# EAGLE schematic Test board - MCP73871 (EAGLE 9.6.2)
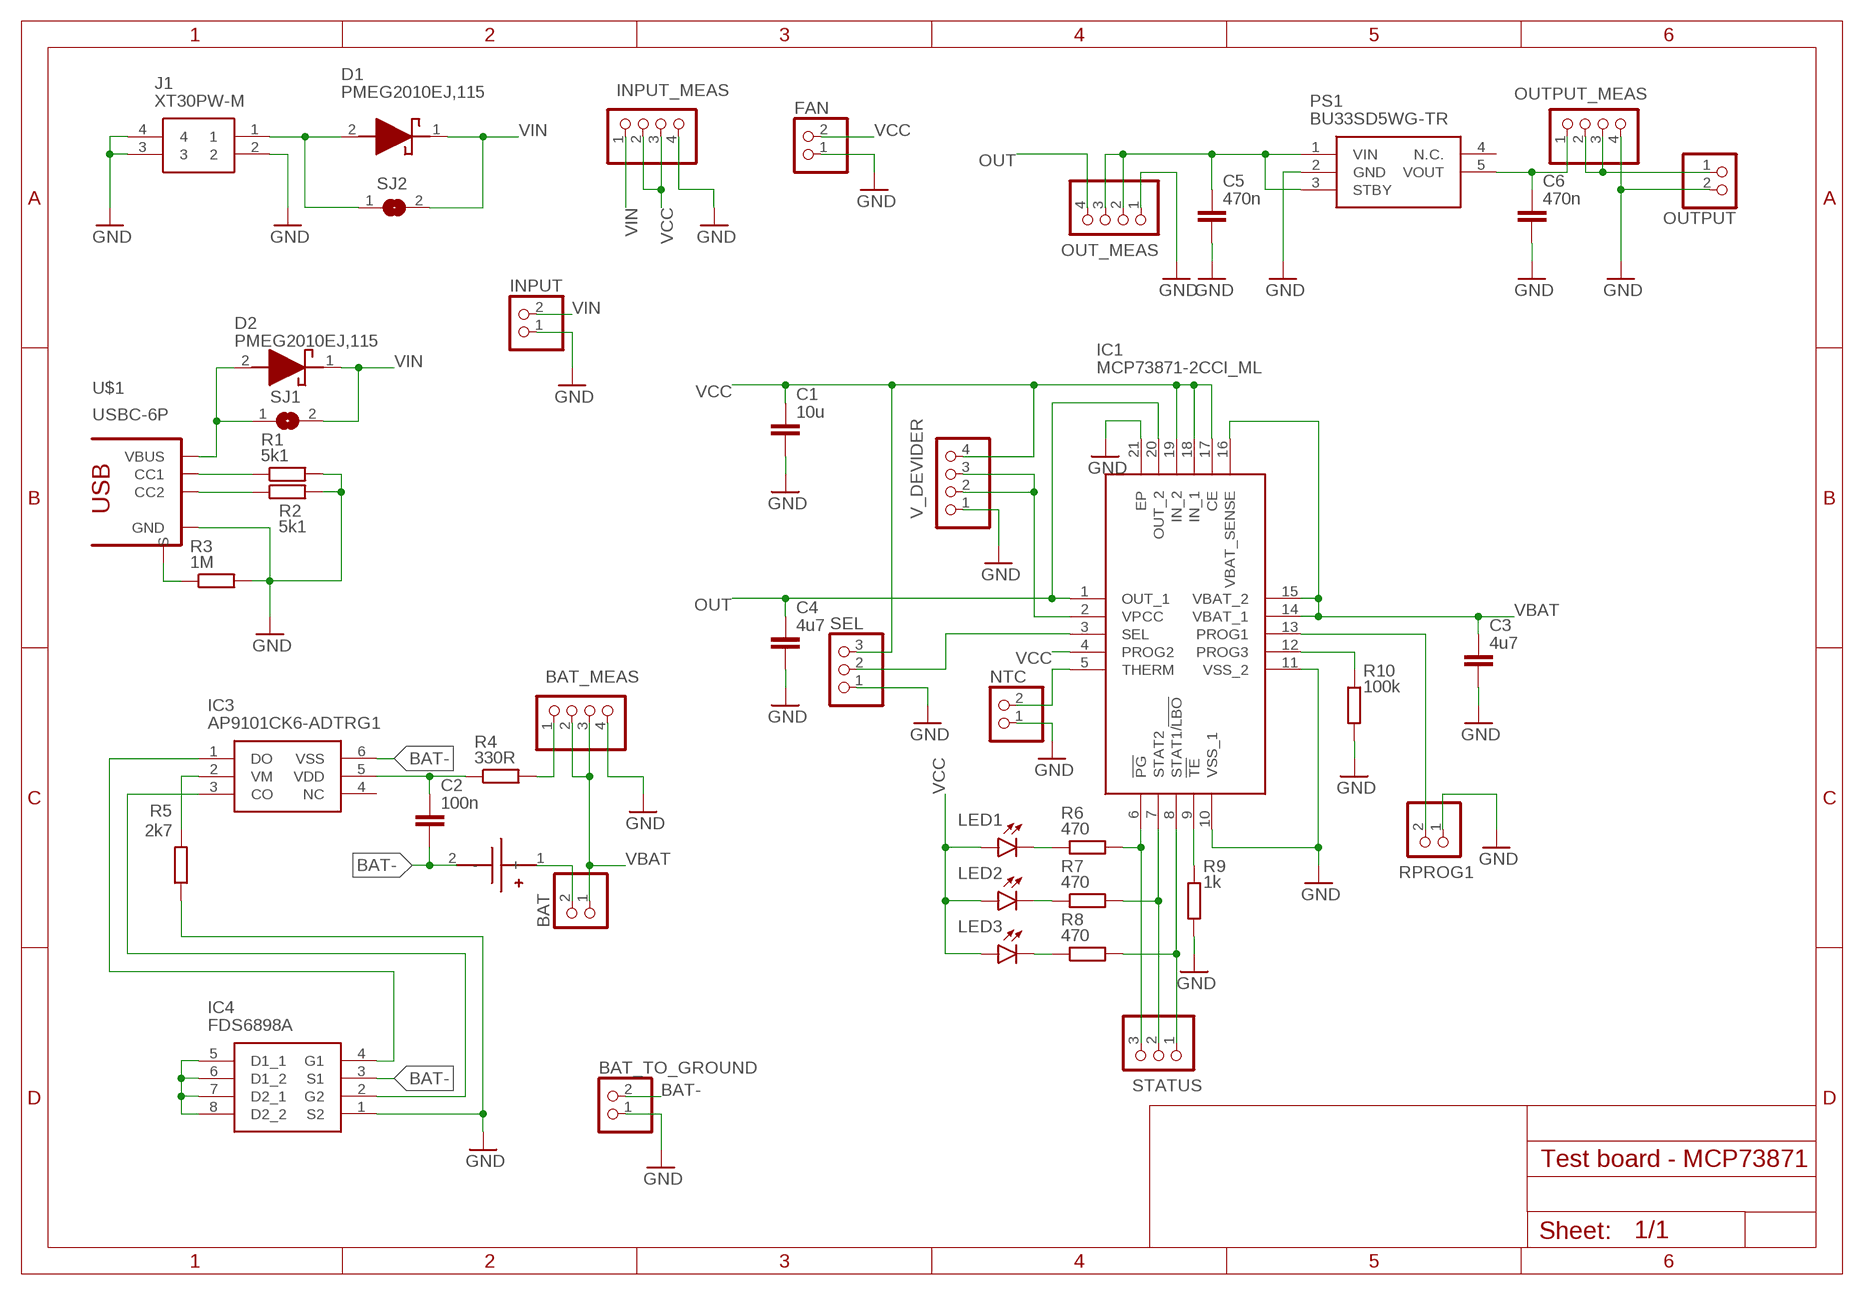
[diagram p0: schematic, sheet 1]

## Parts
BAT  PINHD-1X2  [1X02]
BAT_MEAS  PINHD-1X4  [1X04]
BAT_TO_GROUND  PINHD-1X2  [1X02]
C1  10u  C-EUC0805  [C0805]
C2  100n  C-EUC0805  [C0805]
C3  4u7  C-EUC0805  [C0805]
C4  4u7  C-EUC0805  [C0805]
C5  470n  C-EUC0805  [C0805]
C6  470n  C-EUC0805  [C0805]
D1  PMEG2010EJ,115  [SODFL2512X80N]
D2  PMEG2010EJ,115  [SODFL2512X80N]
FAN  PINHD-1X2  [1X02]
IC1  MCP73871-2CCI_ML  [QFN50P400X400X100-21N]
IC3  AP9101CK6-ADTRG1  [SOT95P285X140-6N]
IC4  FDS6898A  [SOIC127P600X175-8N]
INPUT  PINHD-1X2  [1X02]
INPUT_MEAS  PINHD-1X4  [1X04]
J1  XT30PW-M  [XT30PWM]
LED1  !PG  LEDCHIPLED_0805  [CHIPLED_0805]
LED2  STAT2  LEDCHIPLED_0805  [CHIPLED_0805]
LED3  STAT1  LEDCHIPLED_0805  [CHIPLED_0805]
NTC  PINHD-1X2  [1X02]
OUT_MEAS  PINHD-1X4  [1X04]
OUTPUT  PINHD-1X2  [1X02]
OUTPUT_MEAS  PINHD-1X4  [1X04]
PS1  BU33SD5WG-TR  [SOT95P280X125-5N]
R1  5k1  R-EU_R0805  [R0805]
R2  5k1  R-EU_R0805  [R0805]
R3  1M  R-EU_R0805  [R0805]
R4  330R  R-EU_R0805  [R0805]
R5  2k7  R-EU_R0805  [R0805]
R6  470  R-EU_R0805  [R0805]
R7  470  R-EU_R0805  [R0805]
R8  470  R-EU_R0805  [R0805]
R9  1k  R-EU_R0805  [R0805]
R10  100k  R-EU_R0805  [R0805]
RPROG1  PINHD-1X2  [1X02]
SEL  PINHD-1X3  [1X03]
SJ1  SJ  [SJ]
SJ2  SJ  [SJ]
STATUS  PINHD-1X3  [1X03]
U$1  USBC-6P  [USCX-06FX-XXMX-01]
U$2  BLOSSOM-BLM-18650-1PCS  [BLOSSOM-BLM-18650-1PCS]
V_DEVIDER  PINHD-1X4  [1X04]

## Nets
!PG: IC1.6(!PG) R6.2 STATUS.3
!TE: IC1.9(!TE) R9.1
BAT+: BAT.2 U$2.1(+)
BAT-: BAT_TO_GROUND.2 C2.2 IC3.6(VSS) IC4.3(S1) U$2.2(-)
CC1: R1.1 U$1.CC1
CC2: R2.1 U$1.CC2
DRAIN: IC4.5(D1_1) IC4.6(D1_2) IC4.7(D2_1) IC4.8(D2_2)
G1: IC3.1(DO) IC4.4(G1)
G2: IC3.3(CO) IC4.2(G2)
GND: BAT_MEAS.4 BAT_TO_GROUND.1 C1.2 C3.2 C4.2 C5.2 C6.2 FAN.1 IC1.10(VSS_1) IC1.11(VSS_2) IC1.21(EP) IC4.1(S2) INPUT.1 INPUT_MEAS.4 J1.2 J1.3 J1.4 NTC.1 OUT_MEAS.1 OUTPUT.2 OUTPUT_MEAS.4 PS1.2(GND) R1.2 R2.2 R3.2 R5.1 R9.2 R10.2 RPROG1.1 SEL.1 U$1.GND1(GND) U$1.GND2(GND) V_DEVIDER.1
LDO_VIN: C5.1 OUT_MEAS.2 OUT_MEAS.3 PS1.1(VIN) PS1.3(STBY)
N$6: C2.1 IC3.5(VDD) R4.1
N$7: LED1.C R6.1
N$8: LED2.C R7.1
N$11: LED3.C R8.1
N$14: BAT_MEAS.1 R4.2
OUT: C4.1 IC1.1(OUT_1) IC1.20(OUT_2) OUT_MEAS.4
OUTPUT: OUTPUT.1 OUTPUT_MEAS.2 OUTPUT_MEAS.3
PROG1: IC1.13(PROG1) RPROG1.2
PROG3: IC1.12(PROG3) R10.1
PV_IN: D1.2(A) J1.1 SJ2.1
S: R3.1 U$1.SHIELD1(S) U$1.SHIELD2(S) U$1.SHIELD3(S) U$1.SHIELD4(S)
SEL: IC1.3(SEL) SEL.2
STAT1: IC1.8(STAT1/!LBO) R8.2 STATUS.1
STAT2: IC1.7(STAT2) R7.2 STATUS.2
THERM: IC1.5(THERM) NTC.2
VBAT: BAT.1 BAT_MEAS.2 BAT_MEAS.3 C3.1 IC1.14(VBAT_1) IC1.15(VBAT_2) IC1.16(VBAT_SENSE)
VBUS: D2.2(A) SJ1.1 U$1.VBUS1(VBUS) U$1.VBUS2(VBUS)
VCC: C1.1 FAN.2 IC1.4(PROG2) IC1.17(CE) IC1.18(IN_1) IC1.19(IN_2) INPUT_MEAS.2 INPUT_MEAS.3 LED1.A LED2.A LED3.A SEL.3 V_DEVIDER.4
VIN: D1.1(K) D2.1(K) INPUT.2 INPUT_MEAS.1 SJ1.2 SJ2.2
VM: IC3.2(VM) R5.2
VOUT: C6.1 OUTPUT_MEAS.1 PS1.5(VOUT)
VPCC: IC1.2(VPCC) V_DEVIDER.2 V_DEVIDER.3
Unconnected: IC3.4(NC) PS1.4(N.C.)

## Library data of the parts
BAT BAT_TO_GROUND FAN INPUT NTC OUTPUT RPROG1 = pinhead:PINHD-1X2: PIN HEADER
BAT_MEAS INPUT_MEAS OUT_MEAS OUTPUT_MEAS V_DEVIDER = pinhead:PINHD-1X4: PIN HEADER
C1-C6 = rcl:C-EU: CAPACITOR, European symbol; SPICEPREFIX: C
D1 D2 = 1-component-search:PMEG2010EJ,115: Schottky Diodes & Rectifiers SCHOTTKY 20V 1A Source: Datasheet <https://assets.nexperia.com/documents/data-sheet/PMEG2010EH_EJ_ET.pdf>; ARROW_PART_NUMBER: PMEG2010EJ,115; ARROW_PRICE-STOCK: https://www.arrow.com/en/products/pmeg2010ej115/nexperia?region=nac; DESCRIPTION: Schottky Diodes & Rectifiers SCHOTTKY 20V 1A; HEIGHT: 0.8mm; MANUFACTURER_NAME: Nexperia; MANUFACTURER_PART_NUMBER: PMEG2010EJ,115; MOUSER_PART_NUMBER: 771-PMEG2010EJ-T/R; MOUSER_PRICE-STOCK: https://www.mouser.co.uk/ProductDetail/Nexperia/PMEG2010EJ115?qs=LOCUfHb8d9umE8j0ERLykg%3D%3D
IC1 = 1-component-search:MCP73871-2CCI_ML: Li-Ion Charger USB/DC 4.2V TE LBO QFN20 Source: Datasheet <https://datasheet.datasheetarchive.com/originals/distributors/Datasheets-DGA15/728881.pdf>; ARROW_PART_NUMBER: MCP73871-2CCI/ML; ARROW_PRICE-STOCK: https://www.arrow.com/en/products/mcp73871-2cciml/microchip-technology?region=europe; DESCRIPTION: Li-Ion Charger USB/DC 4.2V TE LBO QFN20; HEIGHT: 1mm; MANUFACTURER_NAME: Microchip; MANUFACTURER_PART_NUMBER: MCP73871-2CCI/ML; MOUSER_PART_NUMBER: 579-MCP73871-2CCI/ML; MOUSER_PRICE-STOCK: https://www.mouser.co.uk/ProductDetail/Microchip-Technology/MCP73871-2CCI-ML?qs=qXsUupcbpXyQfJ2clznZxw%3D%3D
IC3 = 1-component-search:AP9101CK6-ADTRG1: Battery Management Protect w/ Pwr Down 1-Cell LI 3.0uA 3.5V Source: Datasheet <https://www.diodes.com/assets/Datasheets/AP9101C.pdf>; ARROW_PART_NUMBER: AP9101CK6-ADTRG1; ARROW_PRICE-STOCK: https://www.arrow.com/en/products/ap9101ck6-adtrg1/diodes-incorporated?region=nac; DESCRIPTION: Battery Management Protect w/ Pwr Down 1-Cell LI 3.0uA 3.5V; HEIGHT: 1.4mm; MANUFACTURER_NAME: Diodes Inc.; MANUFACTURER_PART_NUMBER: AP9101CK6-ADTRG1; MOUSER_PART_NUMBER: 621-AP9101CK6-ADTRG1; MOUSER_PRICE-STOCK: https://www.mouser.co.uk/ProductDetail/Diodes-Incorporated/AP9101CK6-ADTRG1?qs=W66WzN12R3ZRpT78WZD49g%3D%3D
IC4 = 1-component-search:FDS6898A: ON SEMICONDUCTOR - FDS6898A. - MOSFET, DUAL, N, SMD, SO-8 Source: Datasheet <https://www.onsemi.com/pub/Collateral/FDS6898A-D.PDF>; ARROW_PART_NUMBER: FDS6898A; ARROW_PRICE-STOCK: https://www.arrow.com/en/products/fds6898a/on-semiconductor?region=nac; DESCRIPTION: ON SEMICONDUCTOR - FDS6898A. - MOSFET, DUAL, N, SMD, SO-8; HEIGHT: 1.75mm; MANUFACTURER_NAME: onsemi; MANUFACTURER_PART_NUMBER: FDS6898A; MOUSER_PART_NUMBER: 512-FDS6898A; MOUSER_PRICE-STOCK: https://www.mouser.co.uk/ProductDetail/ON-Semiconductor-Fairchild/FDS6898A?qs=rFoKx6q3%2F911Dc6GES2NNA%3D%3D
J1 = 1-component-search:XT30PW-M: 30A Low Temperature Rise Fire Retardant Plug Source: Datasheet <https://www.tme.eu/sl/Document/ce4077e36b79046da520ca73227e15de/XT30PW SPEC.pdf>; DESCRIPTION: 30A Low Temperature Rise Fire Retardant Plug; HEIGHT: 5mm; MANUFACTURER_NAME: Amass; MANUFACTURER_PART_NUMBER: XT30PW-M
LED1-LED3 = led:LED: LED OSRAM: - CHIPLED LG R971, LG N971, LY N971, LG Q971, LY Q971, LO R971, LY R971 LH N974, LH R974 LS Q976, LO Q976, LY Q976 LO Q996 - Hyper CHIPLED LW Q18S LB Q993, LB Q99A, LB R99A - SideLED LS A670, LO A670, LY A670, LG A670, LP A670 LB A673, LV A673, LT A673, LW A673 LH A674 LY A675 LS A676, LA A676, LO A676, LY A676, LW A676 LS A679, LY A679, LG A679 - Hyper Micro SIDELED® LS Y876, LA Y876, LO Y876, LY Y876 LT Y87S - SmartLED LW L88C, LW L88S LB L89C, LB L89S, LG L890 LS L89K, LO L89K, LY L89K LS L896, LA L896, LO L896, LY L896 - TOPLED LS T670, LO T670, LY T670, LG T670, LP T670 LSG T670, LSP T670, LSY T670, LOP T670, LYG T670 LG T671, LOG T671, LSG T671 LB T673, LV T673, LT T673, LW T673 LH T674 LS T676, LA T676, LO T676, LY T676, LB T676, LH T676, LSB T676, LW T676 LB T67C, LV T67C, LT T67C, LS T67K, LO T67K, LY T67K, LW E67C LS E67B, LA E67B, LO E67B, LY E67B, LB E67C, LV E67C, LT E67C LW T67C LS T679, LY T679, LG T679 LS T770, LO T770, LY T770, LG T770, LP T770 LB T773, LV T773, LT T773, LW T773 LH T774 LS E675, LA E675, LY E675, LS T675 LS T776, LA T776, LO T776, LY T776, LB T776 LHGB T686 LT T68C, LB T68C - Hyper Mini TOPLED® LB M676 - Mini TOPLED Santana® LG M470 LS M47K, LO M47K, LY M47K Source: http://www.osram.convergy.de LUXEON: - LUMILED® LXK2-PW12-R00, LXK2-PW12-S00, LXK2-PW14-U00, LXK2-PW14-V00 LXK2-PM12-R00, LXK2-PM12-S00, LXK2-PM14-U00 LXK2-PE12-Q00, LXK2-PE12-R00, LXK2-PE12-S00, LXK2-PE14-T00, LXK2-PE14-U00 LXK2-PB12-K00, LXK2-PB12-L00, LXK2-PB12-M00, LXK2-PB14-N00, LXK2-PB14-P00, LXK2-PB14-Q00 LXK2-PR12-L00, LXK2-PR12-M00, LXK2-PR14-Q00, LXK2-PR14-R00 LXK2-PD12-Q00, LXK2-PD12-R00, LXK2-PD12-S00 LXK2-PH12-R00, LXK2-PH12-S00 LXK2-PL12-P00, LXK2-PL12-Q00, LXK2-PL12-R00 Source: www.luxeon.com KINGBRIGHT: KA-3528ASYC Source: www.kingbright.com
PS1 = 1-component-search:BU33SD5WG-TR: LDO regulator,3.3V,0.5A,standby,SSOP5 ROHM BU33SD5WG-TR, LDO Voltage Regulator, 0.5A, 3.3 V +/-2%, 1.7 6 Vin, 5-Pin SSOP Source: Datasheet <https://componentsearchengine.com/Datasheets/1/BU33SD5WG-TR.pdf>; DESCRIPTION: LDO regulator,3.3V,0.5A,standby,SSOP5 ROHM BU33SD5WG-TR, LDO Voltage Regulator, 0.5A, 3.3 V +/-2%, 1.7 6 Vin, 5-Pin SSOP; HEIGHT: 1.25mm; MANUFACTURER_NAME: ROHM Semiconductor; MANUFACTURER_PART_NUMBER: BU33SD5WG-TR; MOUSER_PART_NUMBER: 755-BU33SD5WG-TR; MOUSER_PRICE-STOCK: https://www.mouser.co.uk/ProductDetail/ROHM-Semiconductor/BU33SD5WG-TR?qs=%2FKR40Cd6GUrQDzRkUEt69Q%3D%3D
R1-R10 = rcl:R-EU_: RESISTOR, European symbol; SPICEPREFIX: R
SEL STATUS = pinhead:PINHD-1X3: PIN HEADER
SJ1 SJ2 = jumper:SJ: SMD solder JUMPER
U$1 = USBC6P:USBC-6P: AliExpress Special! Connect 5.1k 10% resistors to each CC pin, pulled up to 3.3v or 5.0v.
U$2 = battery-holders:BLOSSOM-BLM-18650-1PCS